# EAGLE design TwoMegCoCo_MMU_v1.0 (EAGLE 7.7.0)
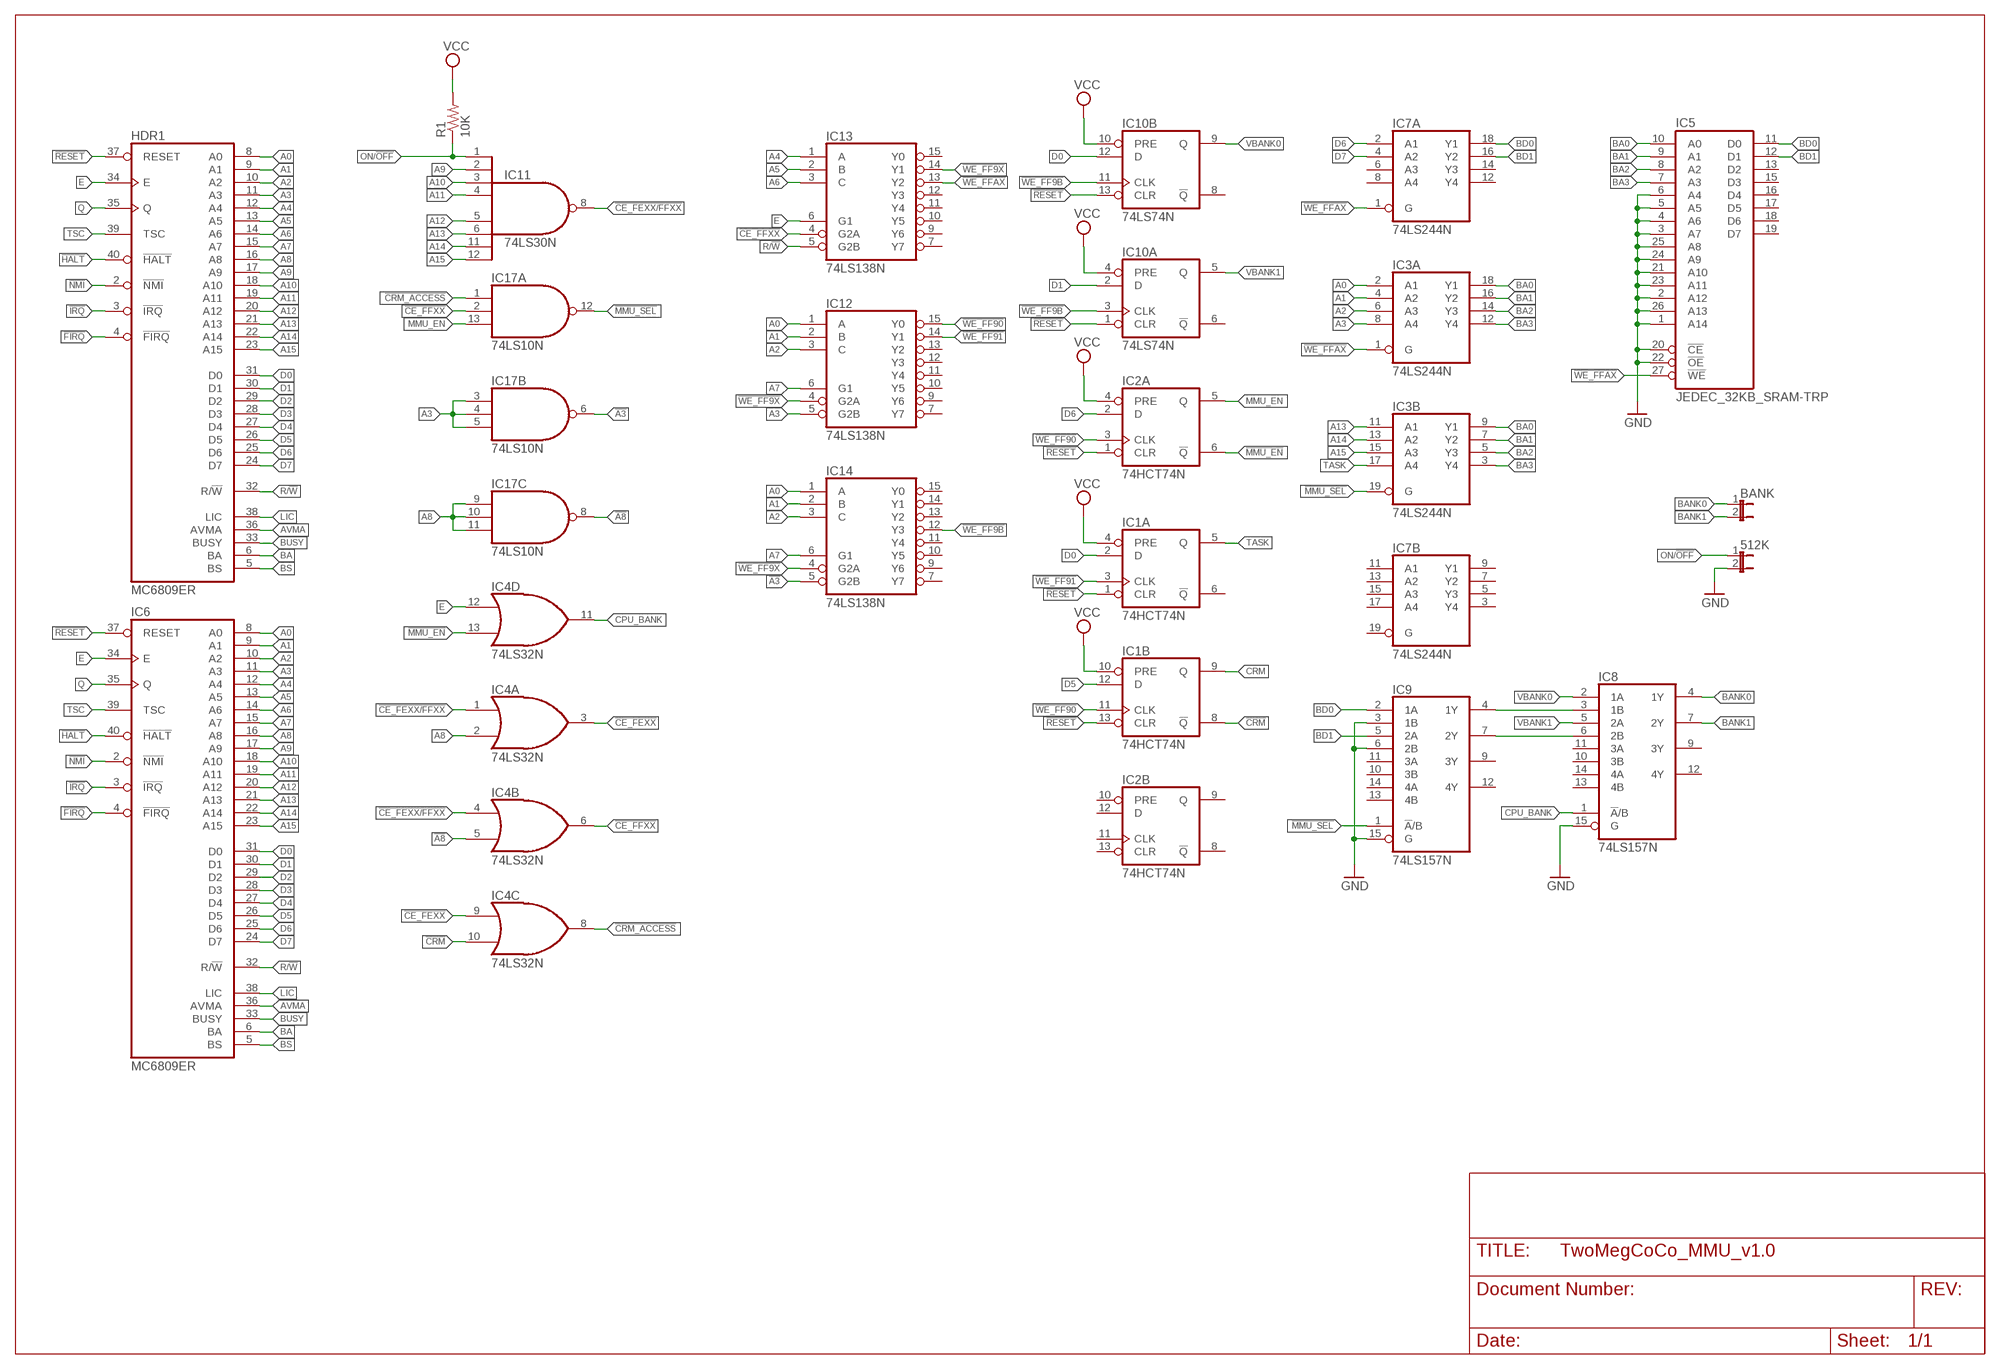
[diagram p0: schematic, sheet 1]

## Parts
512K  JP1E  [JP1]
BANK  JP1E  [JP1]
HDR1  MC6809ER  [DIL40-ROUNDPAD]
IC1  74HCT74N  [DIL14-RP]
IC2  74HCT74N  [DIL14-RP]
IC3  74LS244N  [DIL20-RP]
IC4  74LS32N  [DIL14-RP]
IC5  JEDEC_32KB_SRAM-TRP  [DIL28-3-RP]
IC6  MC6809ER  [DIL40-ROUNDPAD]
IC7  74LS244N  [DIL20-RP]
IC8  74LS157N  [DIL16-RP]
IC9  74LS157N  [DIL16-RP]
IC10  74LS74N  [DIL14-RP]
IC11  74LS30N  [DIL14-RP]
IC12  74LS138N  [DIL16-RP]
IC13  74LS138N  [DIL16-RP]
IC14  74LS138N  [DIL16-RP]
IC17  74LS10N  [DIL14-RP]
R1  10K  R-US_0204/7  [0204/7]

## Nets
!A3: IC14.5(G2B) IC17.6(B:O)
!A8: IC4.5(B:I1) IC17.8(C:O)
!CE_FEXX: IC4.3(A:O) IC4.9(C:I0)
!CE_FEXX/FFXX: IC4.1(A:I0) IC4.4(B:I0) IC11.8(O)
!CE_FFXX: IC4.6(B:O) IC13.4(G2A) IC17.2(A:I1)
!CRM: IC1.8(B:!Q) IC4.10(C:I1)
!CRM_ACCESS: IC4.8(C:O) IC17.1(A:I0)
!FIRQ: HDR1.4(!FIRQ) IC6.4(!FIRQ)
!HALT: HDR1.40(!HALT) IC6.40(!HALT)
!IRQ: HDR1.3(!IRQ) IC6.3(!IRQ)
!MMU_EN: IC2.6(A:!Q) IC4.13(D:I1)
!MMU_SEL: IC3.19(B:G) IC9.1(!A!/B) IC17.12(A:O)
!NMI: HDR1.2(!NMI) IC6.2(!NMI)
!RESET: HDR1.37(RESET) IC1.1(A:CLR) IC1.13(B:CLR) IC2.1(A:CLR) IC6.37(RESET) IC10.1(A:CLR) IC10.13(B:CLR)
!WE_FF9B: IC10.3(A:CLK) IC10.11(B:CLK) IC14.12(Y3)
!WE_FF9X: IC12.4(G2A) IC13.14(Y1) IC14.4(G2A)
!WE_FF90: IC1.11(B:CLK) IC2.3(A:CLK) IC12.15(Y0)
!WE_FF91: IC1.3(A:CLK) IC12.14(Y1)
!WE_FFAX: IC3.1(A:G) IC5.27(!WE) IC7.1(A:G) IC13.13(Y2)
A0: HDR1.8(A0) IC3.2(A:A1) IC6.8(A0) IC12.1(A) IC14.1(A)
A1: HDR1.9(A1) IC3.4(A:A2) IC6.9(A1) IC12.2(B) IC14.2(B)
A2: HDR1.10(A2) IC3.6(A:A3) IC6.10(A2) IC12.3(C) IC14.3(C)
A3: HDR1.11(A3) IC3.8(A:A4) IC6.11(A3) IC12.5(G2B) IC17.3(B:I0) IC17.4(B:I1) IC17.5(B:I2)
A4: HDR1.12(A4) IC6.12(A4) IC13.1(A)
A5: HDR1.13(A5) IC6.13(A5) IC13.2(B)
A6: HDR1.14(A6) IC6.14(A6) IC13.3(C)
A7: HDR1.15(A7) IC6.15(A7) IC12.6(G1) IC14.6(G1)
A8: HDR1.16(A8) IC4.2(A:I1) IC6.16(A8) IC17.9(C:I0) IC17.10(C:I1) IC17.11(C:I2)
A9: HDR1.17(A9) IC6.17(A9) IC11.2(I1)
A10: HDR1.18(A10) IC6.18(A10) IC11.3(I2)
A11: HDR1.19(A11) IC6.19(A11) IC11.4(I3)
A12: HDR1.20(A12) IC6.20(A12) IC11.5(I4)
A13: HDR1.21(A13) IC3.11(B:A1) IC6.21(A13) IC11.6(I5)
A14: HDR1.22(A14) IC3.13(B:A2) IC6.22(A14) IC11.11(I6)
A15: HDR1.23(A15) IC3.15(B:A3) IC6.23(A15) IC11.12(I7)
AVMA: HDR1.36(AVMA) IC6.36(AVMA)
BA: HDR1.6(BA) IC6.6(BA)
BA0: IC3.9(B:Y1) IC3.18(A:Y1) IC5.10(A0)
BA1: IC3.7(B:Y2) IC3.16(A:Y2) IC5.9(A1)
BA2: IC3.5(B:Y3) IC3.14(A:Y3) IC5.8(A2)
BA3: IC3.3(B:Y4) IC3.12(A:Y4) IC5.7(A3)
BANK0: BANK.1 IC8.4(1Y)
BANK1: BANK.2 IC8.7(2Y)
BD0: IC5.11(D0) IC7.18(A:Y1) IC9.2(1A)
BD1: IC5.12(D1) IC7.16(A:Y2) IC9.5(2A)
BS: HDR1.5(BS) IC6.5(BS)
BUSY: HDR1.33(BUSY) IC6.33(BUSY)
CPU_BANK: IC4.11(D:O) IC8.1(!A!/B)
CRM: IC1.9(B:Q)
D0: HDR1.31(D0) IC1.2(A:D) IC6.31(D0) IC10.12(B:D)
D1: HDR1.30(D1) IC6.30(D1) IC10.2(A:D)
D2: HDR1.29(D2) IC6.29(D2)
D3: HDR1.28(D3) IC6.28(D3)
D4: HDR1.27(D4) IC6.27(D4)
D5: HDR1.26(D5) IC1.12(B:D) IC6.26(D5)
D6: HDR1.25(D6) IC2.2(A:D) IC6.25(D6) IC7.2(A:A1)
D7: HDR1.24(D7) IC6.24(D7) IC7.4(A:A2)
E: HDR1.34(E) IC4.12(D:I0) IC6.34(E) IC13.6(G1)
GND: 512K.2 IC5.1(A14) IC5.2(A12) IC5.3(A7) IC5.4(A6) IC5.5(A5) IC5.6(A4) IC5.20(!CE) IC5.21(A10) IC5.22(!OE) IC5.23(A11) IC5.24(A9) IC5.25(A8) IC5.26(A13) IC8.15(G) IC9.3(1B) IC9.6(2B) IC9.15(G)
LIC: HDR1.38(LIC) IC6.38(LIC)
MMU_EN: IC2.5(A:Q) IC17.13(A:I2)
N$1: IC8.3(1B) IC9.4(1Y)
N$2: IC8.6(2B) IC9.7(2Y)
ON/!OFF: 512K.1 IC11.1(I0) R1.1
Q: HDR1.35(Q) IC6.35(Q)
R/!W: HDR1.32(R/!W) IC6.32(R/!W) IC13.5(G2B)
TASK: IC1.5(A:Q) IC3.17(B:A4)
TSC: HDR1.39(TSC) IC6.39(TSC)
VBANK0: IC8.2(1A) IC10.9(B:Q)
VBANK1: IC8.5(2A) IC10.5(A:Q)
VCC: IC1.4(A:PRE) IC1.10(B:PRE) IC2.4(A:PRE) IC10.4(A:PRE) IC10.10(B:PRE) R1.2
Unconnected: IC1.6(A:!Q) IC2.8(B:!Q) IC2.9(B:Q) IC2.10(B:PRE) IC2.11(B:CLK) IC2.12(B:D) IC2.13(B:CLR) IC5.13(D2) IC5.15(D3) IC5.16(D4) IC5.17(D5) IC5.18(D6) IC5.19(D7) IC7.3(B:Y4) IC7.5(B:Y3) IC7.6(A:A3) IC7.7(B:Y2) IC7.8(A:A4) IC7.9(B:Y1) IC7.11(B:A1) IC7.12(A:Y4) IC7.13(B:A2) IC7.14(A:Y3) IC7.15(B:A3) IC7.17(B:A4) IC7.19(B:G) IC8.9(3Y) IC8.10(3B) IC8.11(3A) IC8.12(4Y) IC8.13(4B) IC8.14(4A) IC9.9(3Y) IC9.10(3B) IC9.11(3A) IC9.12(4Y) IC9.13(4B) IC9.14(4A) IC10.6(A:!Q) IC10.8(B:!Q) IC12.7(Y7) IC12.9(Y6) IC12.10(Y5) IC12.11(Y4) IC12.12(Y3) IC12.13(Y2) IC13.7(Y7) IC13.9(Y6) IC13.10(Y5) IC13.11(Y4) IC13.12(Y3) IC13.15(Y0) IC14.7(Y7) IC14.9(Y6) IC14.10(Y5) IC14.11(Y4) IC14.13(Y2) IC14.14(Y1) IC14.15(Y0)

## Power pins joined to a net without a drawn wire
GND: IC1.7(P:GND) IC2.7(P:GND) IC3.10(P:GND) IC4.7(P:GND) IC5.14(GND) IC7.10(P:GND) IC8.8(GND) IC9.8(GND) IC10.7(P:GND) IC11.7(GND) IC12.8(GND) IC13.8(GND) IC14.8(GND) IC17.7(P:GND)
VCC: HDR1.7(VCC) IC1.14(P:VCC) IC2.14(P:VCC) IC3.20(P:VCC) IC4.14(P:VCC) IC5.28(VCC) IC6.7(VCC) IC7.20(P:VCC) IC8.16(VCC) IC9.16(VCC) IC10.14(P:VCC) IC11.14(VCC) IC12.16(VCC) IC13.16(VCC) IC14.16(VCC) IC17.14(P:VCC)
VSS: HDR1.1(VSS) IC6.1(VSS)

## Library data of the parts
512K BANK = jumper-jlb:JP1E: JUMPER
HDR1 IC6 = micro-motorola:MC6809E: MICROCONTROLLER/MEMORY DEVICE
IC1 IC2 IC10 = 74xx-us-jlb:74*74: Dual D type positive edge triggered FLIP FLOP, preset and clear
IC3 IC7 = 74xx-us-jlb:74*244: Octal BUFFER and LINE DRIVER, 3-state
IC4 = 74xx-us-jlb:74*32: Quad 2-input OR gate
IC5 = memory-jedec-jlb:JEDEC_32KB_SRAM: MEMORY
IC8 IC9 = 74xx-us-jlb:74*157: Quadruple 2-line to 1-line data SELECTOR/MULTIPLEXER
IC11 = 74xx-us-jlb:74*30: 8-input NAND gate
IC12-IC14 = 74xx-us-jlb:74*138: 3-line to 8-line DECODER/DEMULTIPLEXER
IC17 = 74xx-us-jlb:74*10: Triple 3-input NAND gate
R1 = resistor:R-US_: RESISTOR, American symbol

## Board
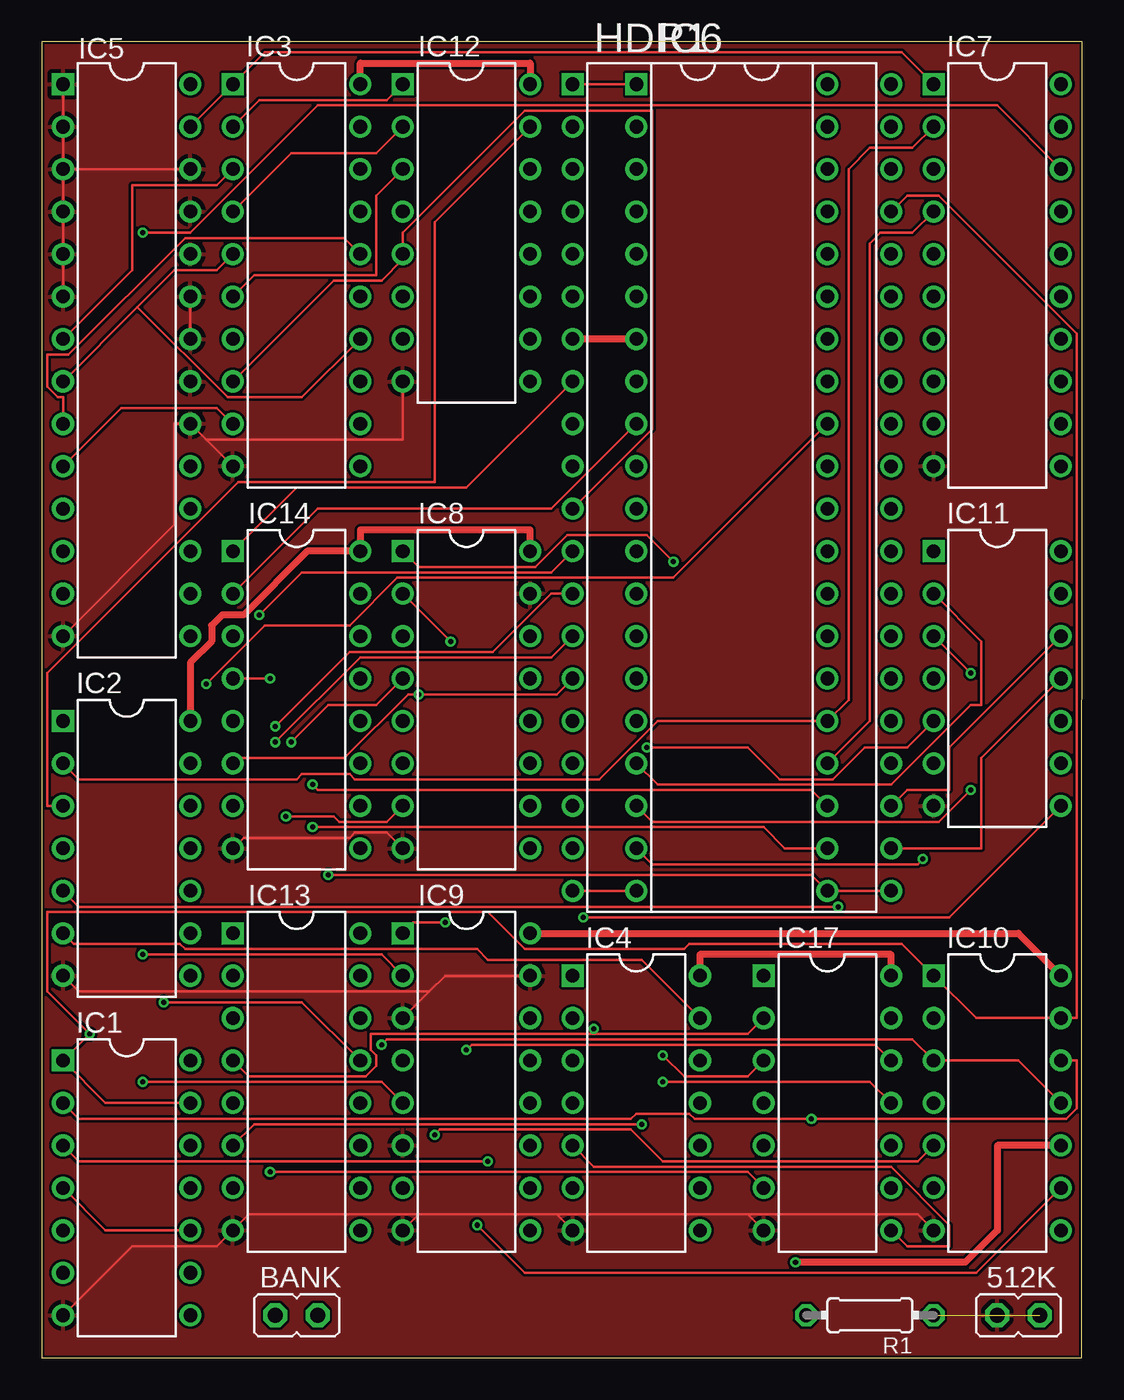
[diagram p1: board, top side]
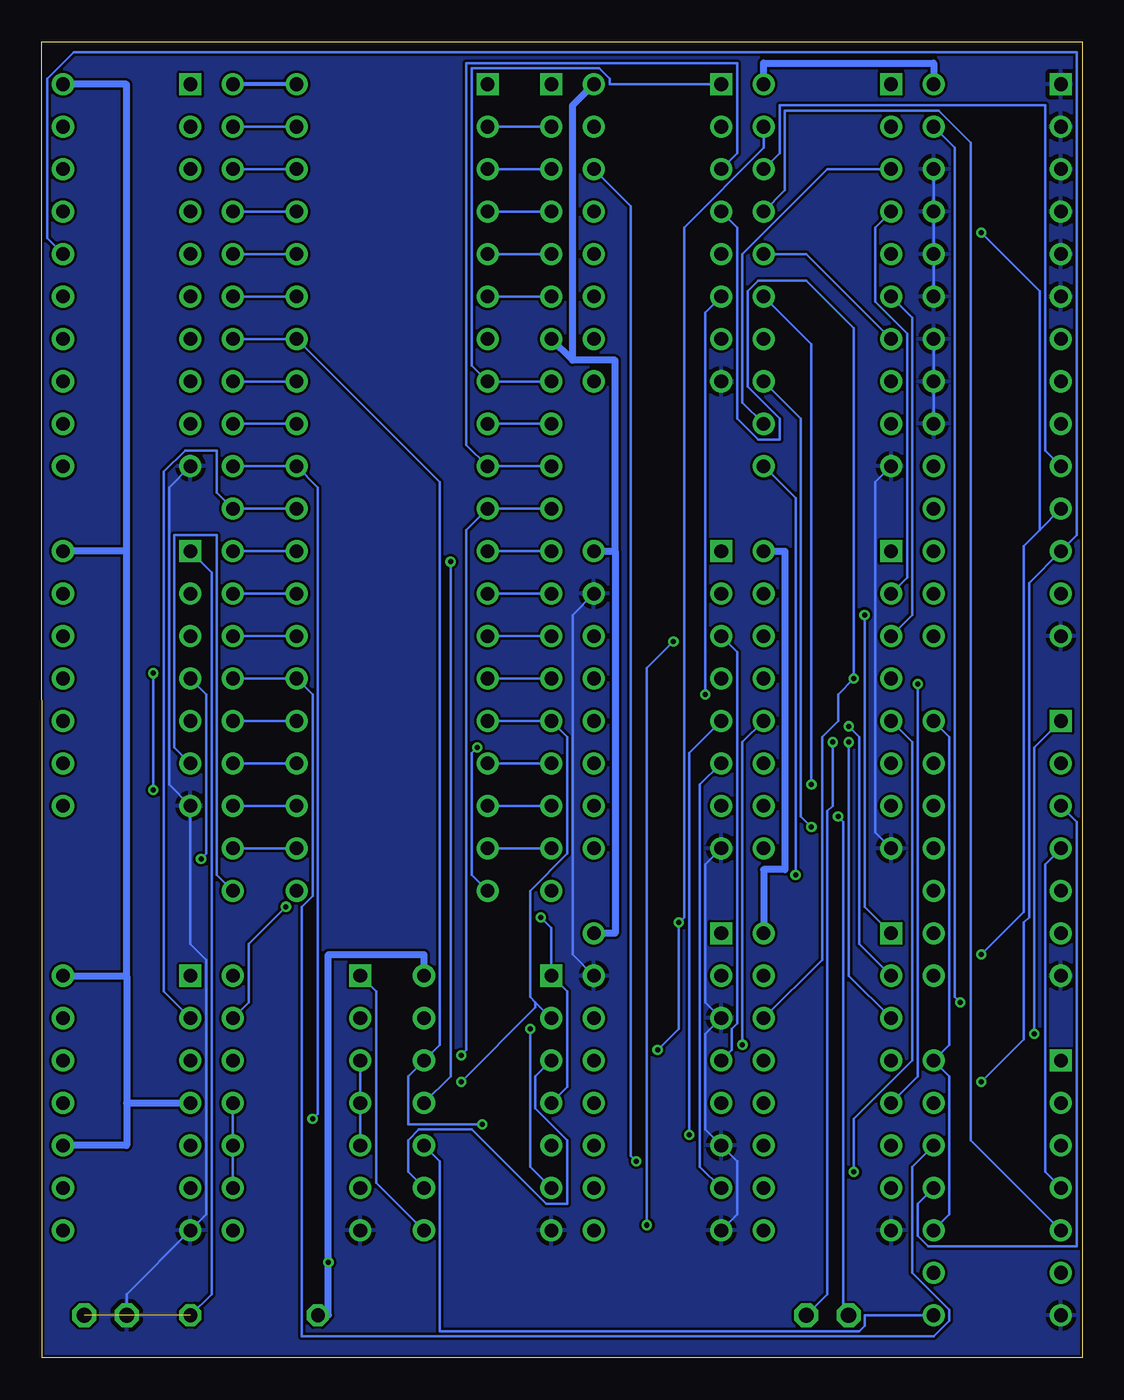
[diagram p2: board, bottom side, seen from below]

Size 62.23 x 78.74 mm. Coordinates in mm from the lower left corner, seen from the top.
Outline: 0,0 62.21,0 62.23,78.74 0,78.74 0,0
Copper layers (1*16): Top 0.035mm / dielectric 1.5mm / Bottom 0.035mm
Design rules "hackvana": minimum track width 6mil, minimum drill 0.3mm, track to track 6mil, track to pad 6mil, pad to pad 6mil, via to via 6mil, smd to smd 0mil, copper to edge 6mil, drill to drill 6mil, minimum pad ring 10mil, minimum via ring 6mil, stop-mask expansion 2mil, vias tented up to drill 100mil, thermal gap 10mil

### Footprints (pad centres in the part's own frame; a part is rotated, then mirrored left to right if it is on the bottom)
JP1 = drill 0.914 octagon: 1 0,-1.27; 2 0,1.27
DIL40-ROUNDPAD = drill 0.813 square: 1 -24.13,-7.62 | drill 0.813: 2 -21.59,-7.62; 3 -19.05,-7.62; 4 -16.51,-7.62; 5 -13.97,-7.62; 6 -11.43,-7.62; 7 -8.89,-7.62; 8 -6.35,-7.62; 9 -3.81,-7.62; 10 -1.27,-7.62; 11 1.27,-7.62; 12 3.81,-7.62; 13 6.35,-7.62; 14 8.89,-7.62; 15 11.43,-7.62; 16 13.97,-7.62; 17 16.51,-7.62; 18 19.05,-7.62; 19 21.59,-7.62; 20 24.13,-7.62; 21 24.13,7.62; 22 21.59,7.62; 23 19.05,7.62; 24 16.51,7.62; 25 13.97,7.62; 26 11.43,7.62; 27 8.89,7.62; 28 6.35,7.62; 29 3.81,7.62; 30 1.27,7.62; 31 -1.27,7.62; 32 -3.81,7.62; 33 -6.35,7.62; 34 -8.89,7.62; 35 -11.43,7.62; 36 -13.97,7.62; 37 -16.51,7.62; 38 -19.05,7.62; 39 -21.59,7.62; 40 -24.13,7.62
DIL14-RP = drill 0.813 square: 1 -7.62,-3.81 | drill 0.813: 2 -5.08,-3.81; 3 -2.54,-3.81; 4 0,-3.81; 5 2.54,-3.81; 6 5.08,-3.81; 7 7.62,-3.81; 8 7.62,3.81; 9 5.08,3.81; 10 2.54,3.81; 11 0,3.81; 12 -2.54,3.81; 13 -5.08,3.81; 14 -7.62,3.81
DIL20-RP = drill 0.813 square: 1 -11.43,-3.81 | drill 0.813: 2 -8.89,-3.81; 3 -6.35,-3.81; 4 -3.81,-3.81; 5 -1.27,-3.81; 6 1.27,-3.81; 7 3.81,-3.81; 8 6.35,-3.81; 9 8.89,-3.81; 10 11.43,-3.81; 11 11.43,3.81; 12 8.89,3.81; 13 6.35,3.81; 14 3.81,3.81; 15 1.27,3.81; 16 -1.27,3.81; 17 -3.81,3.81; 18 -6.35,3.81; 19 -8.89,3.81; 20 -11.43,3.81
DIL28-3-RP = drill 0.813 square: 1 -16.51,-3.81 | drill 0.813: 2 -13.97,-3.81; 3 -11.43,-3.81; 4 -8.89,-3.81; 5 -6.35,-3.81; 6 -3.81,-3.81; 7 -1.27,-3.81; 8 1.27,-3.81; 9 3.81,-3.81; 10 6.35,-3.81; 11 8.89,-3.81; 12 11.43,-3.81; 13 13.97,-3.81; 14 16.51,-3.81; 15 16.51,3.81; 16 13.97,3.81; 17 11.43,3.81; 18 8.89,3.81; 19 6.35,3.81; 20 3.81,3.81; 21 1.27,3.81; 22 -1.27,3.81; 23 -3.81,3.81; 24 -6.35,3.81; 25 -8.89,3.81; 26 -11.43,3.81; 27 -13.97,3.81; 28 -16.51,3.81
DIL16-RP = drill 0.813 square: 1 -8.89,-3.81 | drill 0.813: 2 -6.35,-3.81; 3 -3.81,-3.81; 4 -1.27,-3.81; 5 1.27,-3.81; 6 3.81,-3.81; 7 6.35,-3.81; 8 8.89,-3.81; 9 8.89,3.81; 10 6.35,3.81; 11 3.81,3.81; 12 1.27,3.81; 13 -1.27,3.81; 14 -3.81,3.81; 15 -6.35,3.81; 16 -8.89,3.81
0204/7 = drill 0.813 octagon: 1 -3.81,0; 2 3.81,0

### Placement (x,y rotation side)
512K  58.42,2.54 90 top
BANK  15.24,2.54 90 top
HDR1  39.37,52.07 270 top
IC1  5.08,10.16 270 top
IC2  5.08,30.48 270 top
IC3  15.24,64.77 270 top
IC4  35.56,15.24 270 top
IC5  5.08,59.69 270 top
IC6  43.18,52.07 270 top
IC7  57.15,64.77 270 top
IC8  25.4,39.37 270 top
IC9  25.4,16.51 270 top
IC10  57.15,15.24 270 top
IC11  57.15,40.64 270 top
IC12  25.4,67.31 270 top
IC13  15.24,16.51 270 top
IC14  15.24,39.37 270 top
IC17  46.99,15.24 270 top
R1  49.53,2.54 180 top

### Tracks (layer width: path | path; a pad name or v marks a point on that pad's centre or on a via)
!A3  (via drill 0.3)
  Top 0.152: v13.65,11.11 42.23,11.11 IC17.6
  Bottom 0.152: IC14.5 10.16,36.83 10.16,17.78 13.65,14.29 v13.65,11.11
!A8
  Top 0.152: IC4.5 33.02,11.43 50.8,11.43 54.29,7.94 54.29,6.67 51.75,6.67 IC17.8
!CE_FEXX
  Bottom 0.152: IC4.9 40.32,11.11 40.32,13.02 39.69,13.65 36.51,13.65 32.07,9.21 30.8,9.21 30.8,13.02 32.7,14.92 32.7,16.83 IC4.3
!CE_FEXX/FFXX  (via drill 0.3)
  Top 0.152: IC11.8 54.29,26.35 v32.38,26.35
  Bottom 0.152: IC4.4 30.8,16.19 30.8,21.91 IC4.1 31.75,25.72 v32.38,26.35
!CE_FFXX  (via drill 0.3)
  Top 0.152: IC13.4 12.38,16.83 19.37,16.83 20,17.46 20,18.1 19.68,18.41 19.68,19.37 33.02,19.37 | 33.02,19.37 42.23,19.37 IC17.2 | 33.02,19.37 v33.02,19.68
  Bottom 0.152: IC4.6 33.02,11.43 v33.02,19.68
!CRM
  Bottom 0.152: IC1.8 13.02,2.54 13.02,1.9 13.34,1.59 38.42,1.59 38.42,11.75 IC4.10
!CRM_ACCESS
  Bottom 0.152: IC4.8 42.23,10.48 42.23,21.91 IC17.1
!FIRQ
  Bottom 0.152: IC6.4 HDR1.4
!HALT
  Bottom 0.254: HDR1.40 IC6.40
!IRQ
  Bottom 0.152: HDR1.3 IC6.3
!MMU_EN
  Top 0.152: IC2.6 1.91,24.76 8.26,24.76 8.57,24.45 26.04,24.45 26.67,23.81 35.88,23.81 IC4.13
!MMU_SEL  (via drill 0.3)
  Top 0.152: IC9.1 22.23,26.04 v24.13,26.04 | IC17.12 49.85,18.73 25.72,18.73 v25.4,18.41
  Bottom 0.152: IC3.19 19.05,72.39 23.81,67.63 23.81,26.35 v24.13,26.04 24.13,19.68 v25.4,18.41
!NMI
  Bottom 0.152: HDR1.2 IC6.2
!RESET  (via drill 0.3)
  Top 0.152: IC1.13 3.81,15.24 IC1.1 v2.86,19.37 0.32,21.91 0.32,26.67 26.67,26.67 28.89,24.45 38.42,24.45 38.73,24.76 51.44,24.76 IC10.1 55.88,20.32 IC10.13 61.91,20.32 61.91,61.28 53.66,69.53 51.75,69.53 IC6.37
  Bottom 0.152: IC6.37 HDR1.37 | IC2.1 2.86,36.51 v2.86,19.37
!WE_FF9B  (via drill 0.3)
  Top 0.152: v20.32,18.73 20.64,19.05 52.07,19.05 IC10.3 58.42,17.78 IC10.11
  Bottom 0.152: IC14.12 20.32,36.83 v20.32,18.73
!WE_FF9X  (via drill 0.3)
  Top 0.152: IC14.4 v13.65,40.64
  Bottom 0.152: IC13.14 15.56,23.81 15.56,37.15 14.61,38.1 14.61,39.69 v13.65,40.64 13.65,61.59 16.51,64.45 19.37,64.45 20,63.82 20,58.1 18.1,56.2 18.1,54.93 19.37,54.93 20.64,56.2 20.64,67.63 IC12.4
!WE_FF90
  Top 0.152: IC12.15 23.5,67.95 23.5,52.39 11.75,52.39 0.32,40.96 0.32,33.02 IC2.3
  Bottom 0.152: IC1.11 9.84,9.21 9.84,7.3 9.21,6.67 0.32,6.67 0.32,32.07 IC2.3
!WE_FF91  (via drill 0.3)
  Top 0.152: IC1.3 2.22,11.75 v26.67,11.75
  Bottom 0.152: v26.67,11.75 26.99,12.07 26.99,68.9 IC12.14
!WE_FFAX  (via drill 0.3)
  Top 0.152: IC13.13 15.56,21.27 v7.3,21.27 | IC5.27 IC3.1 13.34,78.11 51.44,78.11 IC7.1
  Bottom 0.152: v7.3,21.27 7.62,21.59 7.62,72.39 IC5.27
A0
  Top 0.152: IC3.2 13.02,75.25 20.64,75.25 IC12.1 | IC14.1 15.24,52.07 25.4,52.07 HDR1.8
  Bottom 0.152: HDR1.8 IC6.8 36.51,59.37 36.51,77.15 28.89,77.15 28.26,76.52 28.26,76.2 IC12.1
A1
  Top 0.152: IC12.2 20,72.07 14.92,72.07 IC3.4 | IC6.9 30.48,50.8 16.51,50.8 IC14.2
  Bottom 0.152: IC6.9 HDR1.9 | IC14.2 10.48,46.67 10.48,61.28 12.38,63.18 12.38,67.63 IC3.4
A2
  Top 0.152: IC12.3 20,69.53 20,64.77 12.7,64.77 IC3.6
  Bottom 0.152: HDR1.10 IC6.10 36.83,54.61 36.83,77.47 20.64,77.47 20.64,72.07 IC12.3 | IC14.3 10.16,44.45 10.16,62.23 IC3.6
A3  (via drill 0.3)
  Top 0.152: IC3.8 17.46,64.45 20.32,64.45 21.59,65.72 IC12.5 21.59,67.31 28.89,74.61 36.51,74.61 36.51,55.56 HDR1.11 | IC17.3 42.23,16.83 38.42,16.83 v37.15,18.1
  Bottom 0.152: HDR1.11 IC6.11 36.83,49.53 36.83,18.41 v37.15,18.1 | IC17.5 IC17.4 IC17.3
A4  (via drill 0.3)
  Top 0.152: v13.02,44.45 15.56,46.99 30.48,46.99 HDR1.12
  Bottom 0.152: IC6.12 HDR1.12 | IC13.1 13.02,26.99 v13.02,44.45
A5  (via drill 0.3)
  Top 0.152: v13.97,37.78 18.41,42.23 26.99,42.23 30.48,45.72 HDR1.13
  Bottom 0.152: HDR1.13 IC6.13 | IC13.2 13.34,24.76 13.34,37.15 v13.97,37.78
A6  (via drill 0.3)
  Top 0.152: v13.97,36.83 19.05,41.91 30.48,41.91 HDR1.14
  Bottom 0.152: IC6.14 HDR1.14 | IC13.3 13.97,22.86 v13.97,36.83
A7  (via drill 0.3)
  Top 0.152: IC14.6 11.75,35.88 18.1,35.88 21.91,39.69 v22.54,39.69 30.8,39.69 HDR1.15
  Bottom 0.152: IC6.15 HDR1.15 | IC12.6 22.54,62.55 v22.54,39.69
A8  (via drill 0.3)
  Top 0.152: IC17.11 49.53,16.51 v37.15,16.51
  Bottom 0.152: IC6.16 HDR1.16 30.8,37.15 30.8,30.16 33.02,27.94 33.02,21.59 32.7,21.27 | IC17.9 IC17.10 IC17.11 | 32.7,21.27 IC4.2 | v37.15,16.51 32.7,20.95 32.7,21.27
A9
  Top 0.152: IC11.2 56.2,42.86 56.2,39.05 55.56,39.05 50.8,34.29 36.83,34.29 IC6.17
  Bottom 0.152: IC6.17 HDR1.17
A10  (via drill 0.3)
  Top 0.152: v55.56,40.96 IC11.3 | v55.56,33.97 53.66,32.07 36.51,32.07 IC6.18
  Bottom 0.152: IC6.18 HDR1.18 | v55.56,33.97 v55.56,40.96
A11  (via drill 0.3)
  Top 0.152: v52.7,29.85 52.39,29.53 36.51,29.53 IC6.19
  Bottom 0.152: IC6.19 HDR1.19 | IC11.4 52.39,39.69 52.39,30.16 v52.7,29.85
A12  (via drill 0.3)
  Top 0.152: IC6.20 HDR1.20 | IC11.5 51.75,36.51 49.21,36.51 47.31,34.61 44.13,34.61 42.23,36.51 v36.2,36.51
  Bottom 0.152: v36.2,36.51 36.51,36.19 36.51,28.89 IC6.20
A13  (via drill 0.3)
  Top 0.152: IC6.21 HDR1.21 46.04,28.89 v17.14,28.89
  Bottom 0.152: IC3.11 17.14,51.44 v17.14,28.89 | IC11.6 54.29,36.51 54.29,49.21 51.75,49.21 51.75,28.89 IC6.21
A14  (via drill 0.3)
  Top 0.152: v16.19,31.75 43.18,31.75 44.45,30.48 HDR1.22 | IC11.11 56.2,35.88 56.2,30.48 IC6.22
  Bottom 0.152: HDR1.22 IC6.22 | IC3.13 16.83,56.2 16.83,32.39 v16.19,31.75
A15  (via drill 0.3)
  Top 0.152: v16.19,34.29 16.51,33.97 46.04,33.97 HDR1.23 | IC11.12 54.29,36.51 54.29,33.97 51.75,33.97 IC6.23
  Bottom 0.152: HDR1.23 IC6.23 | IC3.15 16.19,60.64 v16.19,34.29
AVMA
  Bottom 0.152: HDR1.36 IC6.36
BA
  Bottom 0.152: IC6.6 HDR1.6
BA0
  Top 0.152: IC5.10 4.76,56.83 10.48,56.83 IC3.9
  Bottom 0.152: IC3.18 18.1,72.07 18.1,74.93 2.22,74.93 2.22,54.29 IC5.10
BA1
  Top 0.152: IC5.9 1.27,57.47 0.95,57.47 0.32,58.1 0.32,60.01 1.59,60.01 8.57,66.99 18.1,66.99 IC3.16
  Bottom 0.152: IC3.7 16.51,66.04 IC3.16
BA2
  Top 0.152: 5.71,62.87 7.94,65.09 10.48,65.09 IC3.5 | 5.71,62.87 IC5.8 | IC3.14 15.56,57.47 11.11,57.47 5.71,62.87
BA3
  Top 0.152: IC5.7 5.4,65.09 5.4,70.17 10.48,70.17 IC3.3
  Bottom 0.152: IC3.12 20.32,57.15 20.32,66.04 15.24,71.12 IC3.3
BANK0  (via drill 0.3)
  Top 0.152: IC8.4 20,39.05 17.14,39.05 v14.92,36.83
  Bottom 0.152: v14.92,36.83 14.92,33.02 15.24,32.7 15.24,3.81 BANK.1
BANK1  (via drill 0.3)
  Top 0.152: IC8.7 20.64,32.07 17.78,32.07 17.46,32.39 v14.61,32.39
  Bottom 0.152: v14.61,32.39 14.29,32.07 14.29,2.86 BANK.2
BD0  (via drill 0.3)
  Top 0.152: IC9.2 20.32,24.13 v6.03,24.13 | IC7.18 57.15,74.93 16.51,74.93 8.89,67.31 v6.03,67.31
  Bottom 0.152: v6.03,24.13 3.49,26.67 3.49,48.58 2.54,49.53 | IC5.11 2.54,49.53 | v6.03,67.31 2.54,63.82 2.54,49.53
BD1  (via drill 0.3)
  Top 0.152: IC9.5 20.32,16.51 v6.03,16.51
  Bottom 0.152: v6.03,16.51 3.49,19.05 3.49,26.04 3.17,26.35 3.17,46.36 IC5.12 0.32,49.21 0.32,78.11 60.33,78.11 61.91,76.52 61.91,66.99 IC7.16
BS
  Bottom 0.152: HDR1.5 IC6.5
BUSY
  Bottom 0.152: HDR1.33 IC6.33
CPU_BANK  (via drill 0.3)
  Top 0.152: v37.78,47.62 36.2,49.21 31.43,49.21 29.53,47.31 22.54,47.31 IC8.1
  Bottom 0.152: IC4.11 37.78,16.83 v37.78,47.62
D0  (via drill 0.3)
  Top 0.152: IC1.2 2.22,14.29 35.24,14.29 35.56,14.61 38.73,14.61 39.05,14.29 v46.04,14.29 61.28,14.29 61.91,14.92 61.91,17.78 IC10.12
  Bottom 0.152: IC6.31 HDR1.31 45.72,52.07 45.72,14.61 v46.04,14.29
D1
  Bottom 0.152: HDR1.30 IC6.30 51.75,51.75 51.75,54.29 53.66,54.29 54.93,53.02 54.93,21.91 IC10.2
D2
  Bottom 0.152: HDR1.29 IC6.29
D3
  Bottom 0.152: IC6.28 HDR1.28
D4
  Bottom 0.152: HDR1.27 IC6.27
D5
  Bottom 0.152: IC6.26 HDR1.26 46.04,39.69 46.04,27.62 46.67,26.99 46.67,1.27 8.89,1.27 7.94,2.22 7.94,2.86 10.16,5.08 10.16,11.43 IC1.12
D6
  Top 0.152: IC7.2 52.07,72.39 49.53,72.39 48.26,71.12 48.26,39.37 HDR1.25 36.83,38.1 33.34,34.61 18.73,34.61 18.41,34.92 15.56,34.92 15.24,34.61 2.22,34.61 IC2.2
  Bottom 0.152: HDR1.25 IC6.25
D7
  Top 0.152: HDR1.24 49.53,38.1 49.53,66.67 50.16,67.31 52.07,67.31 IC7.4
  Bottom 0.152: HDR1.24 IC6.24
E  (via drill 0.3)
  Top 0.152: IC13.6 12.7,13.97 v35.88,13.97
  Bottom 0.152: IC6.34 HDR1.34 38.42,52.39 38.42,18.73 IC4.12 40.32,16.83 40.32,13.97 v35.88,13.97
GND
  Top 0.152: IC5.1 IC5.2 IC5.3 | IC5.6 IC5.5 IC5.4 IC5.3 | IC5.22 IC5.23 | IC5.14 7.94,49.85 7.94,55.88 IC5.20 9.84,54.93 | 9.84,54.93 IC3.10 | IC12.8 21.59,54.93 9.84,54.93 | IC5.26 IC5.3 | IC14.8 12.06,31.11 18.41,31.11 18.73,31.43 20.64,31.43 IC8.8 | 23.18,21.91 24.13,22.86 IC9.15 | 23.18,21.91 IC9.3 | IC2.7 2.22,21.91 23.18,21.91 | IC1.7 5.4,6.67 10.48,6.67 IC13.8 12.38,8.57 22.54,8.57 | 30.8,8.57 IC4.7 | 22.54,8.57 30.8,8.57 | IC9.8 22.54,8.57 | 42.23,8.57 IC17.7 | 30.8,8.57 42.23,8.57 | IC10.7 52.39,8.57 42.23,8.57
  Bottom 0.152: IC5.22 IC5.21 IC5.20 | IC5.26 IC5.25 IC5.24 IC5.23 | IC8.15 30.48,44.45 30.48,24.13 IC9.15 | IC8.8 22.54,29.53 22.54,21.27 IC9.3 22.54,19.37 22.54,13.65 IC9.6 20.64,11.75 20.64,8.57 IC9.8 | IC7.10 54.61,52.07 54.61,34.29 IC11.7 53.34,24.76 52.39,23.81 52.39,8.57 IC10.7 57.15,3.81 512K.2 | IC3.10 12.38,52.39 12.38,31.43 IC14.8
  pour Bottom: 0,78.74 62.23,78.74 62.23,0 0,0
  pour Top: 0,78.74 62.23,78.74 62.23,0 0,0
LIC
  Bottom 0.152: HDR1.38 IC6.38
MMU_EN  (via drill 0.3)
  Top 0.152: IC2.5 2.22,26.99 v47.62,26.99
  Bottom 0.152: v47.62,26.99 49.85,24.76 49.85,21.27 IC17.13
N$1
  Bottom 0.152: IC9.4 20.95,18.41 20.95,19.68 20.64,20 20.64,42.23 IC8.3
N$2
  Bottom 0.152: IC9.7 22.86,11.43 22.86,34.29 IC8.6
ON/!OFF  (1 unrouted)
  Bottom 0.152: R1.1 52.07,3.81 52.07,46.99 IC11.1
Q
  Bottom 0.152: HDR1.35 IC6.35
R/!W  (via drill 0.3)
  Top 0.152: v9.84,40.32 13.34,43.81 18.41,43.81 21.27,46.67 37.78,46.67 HDR1.32
  Bottom 0.152: IC6.32 HDR1.32 | IC13.5 9.84,16.83 v9.84,40.32
TASK
  Bottom 0.152: IC1.5 6.67,13.02 6.67,72.71 8.57,74.61 17.78,74.61 17.78,69.85 IC3.17
TSC
  Bottom 0.152: IC6.39 HDR1.39
VBANK0  (via drill 0.3)
  Top 0.152: v24.45,42.86 IC8.2 | v26.04,7.94 28.89,5.08 55.88,5.08 IC10.9
  Bottom 0.152: v24.45,42.86 26.04,41.28 v26.04,7.94
VBANK1  (via drill 0.3)
  Top 0.152: v23.5,13.34 23.81,13.65 35.24,13.65 37.15,11.75 52.39,11.75 IC10.5
  Bottom 0.152: IC8.5 23.5,36.19 v23.5,13.34
VCC  (via drill 0.3)
  Top 0.152: IC1.4 3.81,7.62 IC1.10
  Top 0.406: IC4.14 39.37,24.13 50.8,24.13 IC17.14 | v45.09,5.71 55.24,5.71 57.15,7.62 57.15,12.7 IC10.10 | IC2.14 8.89,41.59 10.16,42.86 10.16,43.81 10.79,44.45 12.06,44.45 15.88,48.26 IC14.16 19.05,49.53 29.21,49.53 IC8.16 | IC12.16 29.21,77.47 19.05,77.47 IC3.20 | IC6.7 HDR1.7 | IC10.14 58.42,25.4 IC9.16
  Bottom 0.152: IC1.10 7.94,8.57 7.94,16.83 IC1.14 7.94,18.73 7.94,37.15 IC2.14 | IC2.4 2.22,29.53 2.22,11.11 IC1.4
  Bottom 0.406: IC4.14 39.37,24.13 45.09,24.13 v45.09,5.71 45.09,2.54 R1.2 | IC10.14 57.15,22.86 | 57.15,22.86 57.15,15.24 | 57.15,15.24 IC10.4 | 57.15,48.26 IC11.14 | 57.15,22.86 57.15,48.26 | IC7.20 57.15,76.2 57.15,48.26 | 57.15,15.24 57.15,12.7 IC10.10 | IC13.16 19.05,29.21 17.78,29.21 17.78,48.26 IC14.16 | IC5.28 8.89,77.47 19.05,77.47 IC3.20 | IC9.16 27.94,25.4 27.94,48.26 | IC8.16 27.94,48.26 | 30.48,59.69 27.94,59.69 27.94,48.26 | 30.48,59.69 HDR1.7 | IC12.16 30.48,74.93 30.48,59.69
VSS
  Top 0.152: IC6.1 HDR1.1